# Altium project ESC.PrjPcb (part 1 of 2)
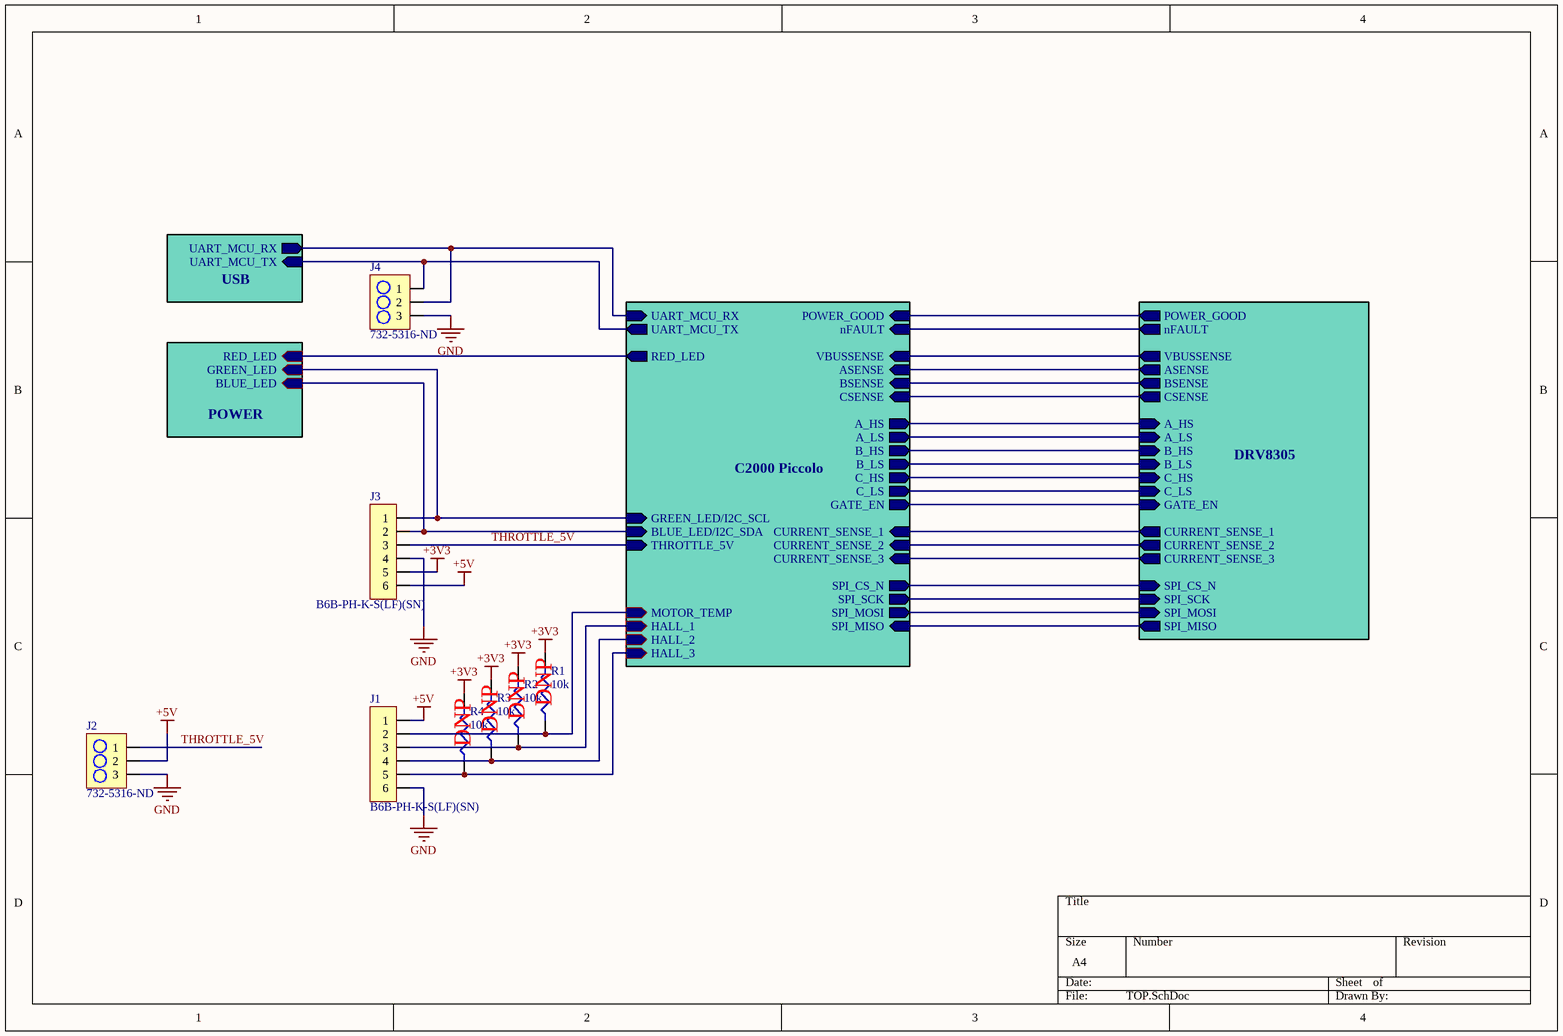
[diagram p0: TOP.SchDoc]
5 sheets, 103 parts. Net scope: hierarchical (ports join the sheet entries above them; power ports are global).
Board file: ESC_BOARD.PcbDoc
Sheets:
  TOP.SchDoc
    C2000 Piccolo = MCU.SchDoc
    DRV8305 = DRIVER.SchDoc
    USB = USB.SchDoc
    POWER = POWER.SchDoc

## Sheet TOP.SchDoc
size A4

### Parts
J1  B6B-PH-K-S(LF)(SN)  [JST-PH-6]
J2  732-5316-ND  [3PIN_HEADER]
J3  B6B-PH-K-S(LF)(SN)  [JST-PH-6]
J4  732-5316-ND  [3PIN_HEADER]
R1  10k  [R0402]
R2  10k  [R0402]
R3  10k  [R0402]
R4  10k  [R0402]

### Sub-sheets
C2000 Piccolo = MCU.SchDoc: VBUSSENSE, ASENSE, BSENSE, CSENSE, A_HS, A_LS, B_HS, B_LS, C_HS, C_LS, GATE_EN, CURRENT_SENSE_1, CURRENT_SENSE_2, CURRENT_SENSE_3, SPI_CS_N, SPI_SCK, SPI_MOSI, SPI_MISO, POWER_GOOD, nFAULT, UART_MCU_RX, UART_MCU_TX, RED_LED, THROTTLE_5V, HALL_3, HALL_1, HALL_2, MOTOR_TEMP, BLUE_LED/I2C_SDA, GREEN_LED/I2C_SCL
DRV8305 = DRIVER.SchDoc: ASENSE, BSENSE, CSENSE, A_HS, A_LS, B_HS, B_LS, C_HS, C_LS, GATE_EN, SPI_CS_N, SPI_SCK, SPI_MOSI, SPI_MISO, nFAULT, POWER_GOOD, VBUSSENSE, CURRENT_SENSE_1, CURRENT_SENSE_2, CURRENT_SENSE_3
POWER = POWER.SchDoc: GREEN_LED, RED_LED, BLUE_LED
USB = USB.SchDoc: UART_MCU_RX, UART_MCU_TX

### Nets
+3V3: J3.5 R1.2 R2.2 R3.2 R4.2
+5V: J1.1 J2.2 J3.6
GND: J1.6 J2.3 J3.4 J4.3
A_HS: sheet C2000 Piccolo/A_HS, sheet DRV8305/A_HS
A_LS: sheet C2000 Piccolo/A_LS, sheet DRV8305/A_LS
ASENSE: sheet C2000 Piccolo/ASENSE, sheet DRV8305/ASENSE
B_HS: sheet C2000 Piccolo/B_HS, sheet DRV8305/B_HS
B_LS: sheet C2000 Piccolo/B_LS, sheet DRV8305/B_LS
BLUE_LED: J3.2 ; sheet C2000 Piccolo/BLUE_LED/I2C_SDA, sheet POWER/BLUE_LED
BSENSE: sheet C2000 Piccolo/BSENSE, sheet DRV8305/BSENSE
C_HS: sheet C2000 Piccolo/C_HS, sheet DRV8305/C_HS
C_LS: sheet C2000 Piccolo/C_LS, sheet DRV8305/C_LS
CSENSE: sheet C2000 Piccolo/CSENSE, sheet DRV8305/CSENSE
CURRENT_SENSE_1: sheet C2000 Piccolo/CURRENT_SENSE_1, sheet DRV8305/CURRENT_SENSE_1
CURRENT_SENSE_2: sheet C2000 Piccolo/CURRENT_SENSE_2, sheet DRV8305/CURRENT_SENSE_2
CURRENT_SENSE_3: sheet C2000 Piccolo/CURRENT_SENSE_3, sheet DRV8305/CURRENT_SENSE_3
GATE_EN: sheet C2000 Piccolo/GATE_EN, sheet DRV8305/GATE_EN
GREEN_LED: J3.1 ; sheet C2000 Piccolo/GREEN_LED/I2C_SCL, sheet POWER/GREEN_LED
HALL_1: J1.3 R2.1 ; sheet C2000 Piccolo/HALL_1
HALL_2: J1.4 R3.1 ; sheet C2000 Piccolo/HALL_2
HALL_3: J1.5 R4.1 ; sheet C2000 Piccolo/HALL_3
MOTOR_TEMP: J1.2 R1.1 ; sheet C2000 Piccolo/MOTOR_TEMP
nFAULT: sheet C2000 Piccolo/nFAULT, sheet DRV8305/nFAULT
POWER_GOOD: sheet C2000 Piccolo/POWER_GOOD, sheet DRV8305/POWER_GOOD
RED_LED: sheet C2000 Piccolo/RED_LED, sheet POWER/RED_LED
SPI_CS_N: sheet C2000 Piccolo/SPI_CS_N, sheet DRV8305/SPI_CS_N
SPI_MISO: sheet C2000 Piccolo/SPI_MISO, sheet DRV8305/SPI_MISO
SPI_MOSI: sheet C2000 Piccolo/SPI_MOSI, sheet DRV8305/SPI_MOSI
SPI_SCK: sheet C2000 Piccolo/SPI_SCK, sheet DRV8305/SPI_SCK
THROTTLE_5V: J2.1 J3.3 ; sheet C2000 Piccolo/THROTTLE_5V
UART_MCU_RX: J4.2 ; sheet C2000 Piccolo/UART_MCU_RX, sheet USB/UART_MCU_RX
UART_MCU_TX: J4.1 ; sheet C2000 Piccolo/UART_MCU_TX, sheet USB/UART_MCU_TX
VBUSSENSE: sheet C2000 Piccolo/VBUSSENSE, sheet DRV8305/VBUSSENSE

### Notes on the sheet
- (near R2) DNP
- (near R1) DNP
- (near R4) DNP
- (near R3) DNP

### Library data of the parts
J1 J3 = B6B-PH-K-S(LF)(SN): CONN JST PH 6 Positions Header, Shrouded Connector 0.079" (2.00mm) Through Hole Tin; Number of Positions: 6; Connector Type: Male Pin; Contact Resistance: 20mR; Current Rating: 2A; Insulation Resistance: 1MR; Max Voltage Rating (AC): 100V; Gender: Male; Pitch: 2mm; Supplier 1: Digi-Key; Manufacturer: JST; Manufacturer Part Number: B6B-PH-K-S(LF)(SN); Stock 1: 75035; Pricing 1: 1=0.33, 10=0.313, 100=0.2194, 500=0.1881, 1000=0.1567, 5000=0.1344, 10000=0.1254 (USD); Mount: Through Hole; Number of Pins: 6; Contact Plating: Copper,Tin; Colour: Natural; Contact Material: Brass,Tin; Housing Colour: White; Housing Material: Polyamide; Min Operating Temperature: -25°C; Max Operating Temperature: 85°C; Number of Rows: 1; Packaging: Bulk; Max Current Rating: 2A; Termination: Solder; Number of Contacts: 6; Orientation: Straight; Voltage Rating (AC): 100V; Voltage Rating: 100V; Fastening Type: Detent; Working Voltage: 100V; Number of Poles: 6; Length: 13.9mm; Height: 9.4mm; Width: 4.5mm; Depth: 4.5mm; Lead Pitch: 2mm; Contact Mating Length: 0.13inch; Lead Free: Lead Free; REACH SVHC: No SVHC; ComponentLink1URL: https://datasheet.ciiva.com/712/eph-712563.pdf; ComponentLink1Description: https://datasheet.ciiva.com/712/eph-712563.pdf; ComponentLink2URL: https://datasheet.ciiva.com/26894/getdatasheetpartid-639917-26894487.pdf; ComponentLink2Description: https://datasheet.ciiva.com/26894/getdatasheetpartid-639917-26894487.pdf; ComponentLink3URL: https://datasheet.ciiva.com/11747/0900766b8082f554-11747368.pdf; ComponentLink3Description: https://datasheet.ciiva.com/11747/0900766b8082f554-11747368.pdf; ComponentLink4URL: https://datasheet.ciiva.com/20207/523648-20207241.pdf; ComponentLink4Description: https://datasheet.ciiva.com/20207/523648-20207241.pdf; ComponentLink5URL: https://datasheet.ciiva.com/8052/80560-8052027.pdf; ComponentLink5Description: https://datasheet.ciiva.com/8052/80560-8052027.pdf; Supplier Part Number 1: 455-1708-ND
J2 J4 = 61300311121: CONN_HeaderPins3pos WURTH ELEKTRONIK Board-To-Board Connector, Vertical, WR-PHD Series, Through Hole, Header, 3 Contacts, 2.54 mm; Manufacturer: Wurth Electronics; Number of Positions: 3; Gender: Male; Connector Type: Male Pin; Pitch: 0.1inch; Supplier 1: Digi-Key; Manufacturer Part Number: 61300311121; Stock 1: 57026; Pricing 1: 1=0.13, 10=0.106, 25=0.088, 50=0.074, 100=0.067, 1000=0.061 (USD); Mount: Through Hole; Case/Package: 100; Contact Plating: Gold; Contact Material: Copper; Colour: Black; Number of Rows: 1; Packaging: Bulk; Termination: Solder; Number of Contacts: 3; Contact Mating Length: 0.236inch; REACH SVHC: Unknown; Lead Free: Lead Free; ComponentLink1URL: http://www.farnell.com/cad/1737268.pdf; ComponentLink1Description: http://www.farnell.com/cad/1737268.pdf; Supplier Part Number 1: 732-5316-ND
R1-R4 = RC0402JR-0710KL: RES SMD 10K OHM 5% 1/16W 0402; Manufacturer: Yageo; Resistance: 10kR; Power Rating: 62.5mW; Voltage Rating: 50V; Temperature Coefficient: 100ppm/°C; Max Power Dissipation: 63mW; Supplier 1: Digi-Key; Manufacturer Part Number: RC0402JR-0710KL; Stock 1: 47303622; Pricing 1: 1=0.1, 10=0.018, 100=0.0073, 1000=0.0033, 2500=0.0029, 5000=0.0024 (USD); Case/Package: 0402; Case Code (Metric): 1005; Case Code (Imperial): 0402; Min Operating Temperature: -55°C; Max Operating Temperature: 155°C; Packaging: Tape and Reel; Tolerance: 5%; Package Quantity: 1; Composition: Thick Film; Number of Terminations: 2; Termination: SMD/SMT; Military Standard: Not; Features: Moisture Resistant; Length: 1mm; Height: 0.016inch; Width: 0.02inch; Depth: 0.5mm; REACH SVHC: Unknown; Lead Free: Lead Free; Supplier Part Number 1: 311-10KJRCT-ND

## Sheet MCU.SchDoc
size A4
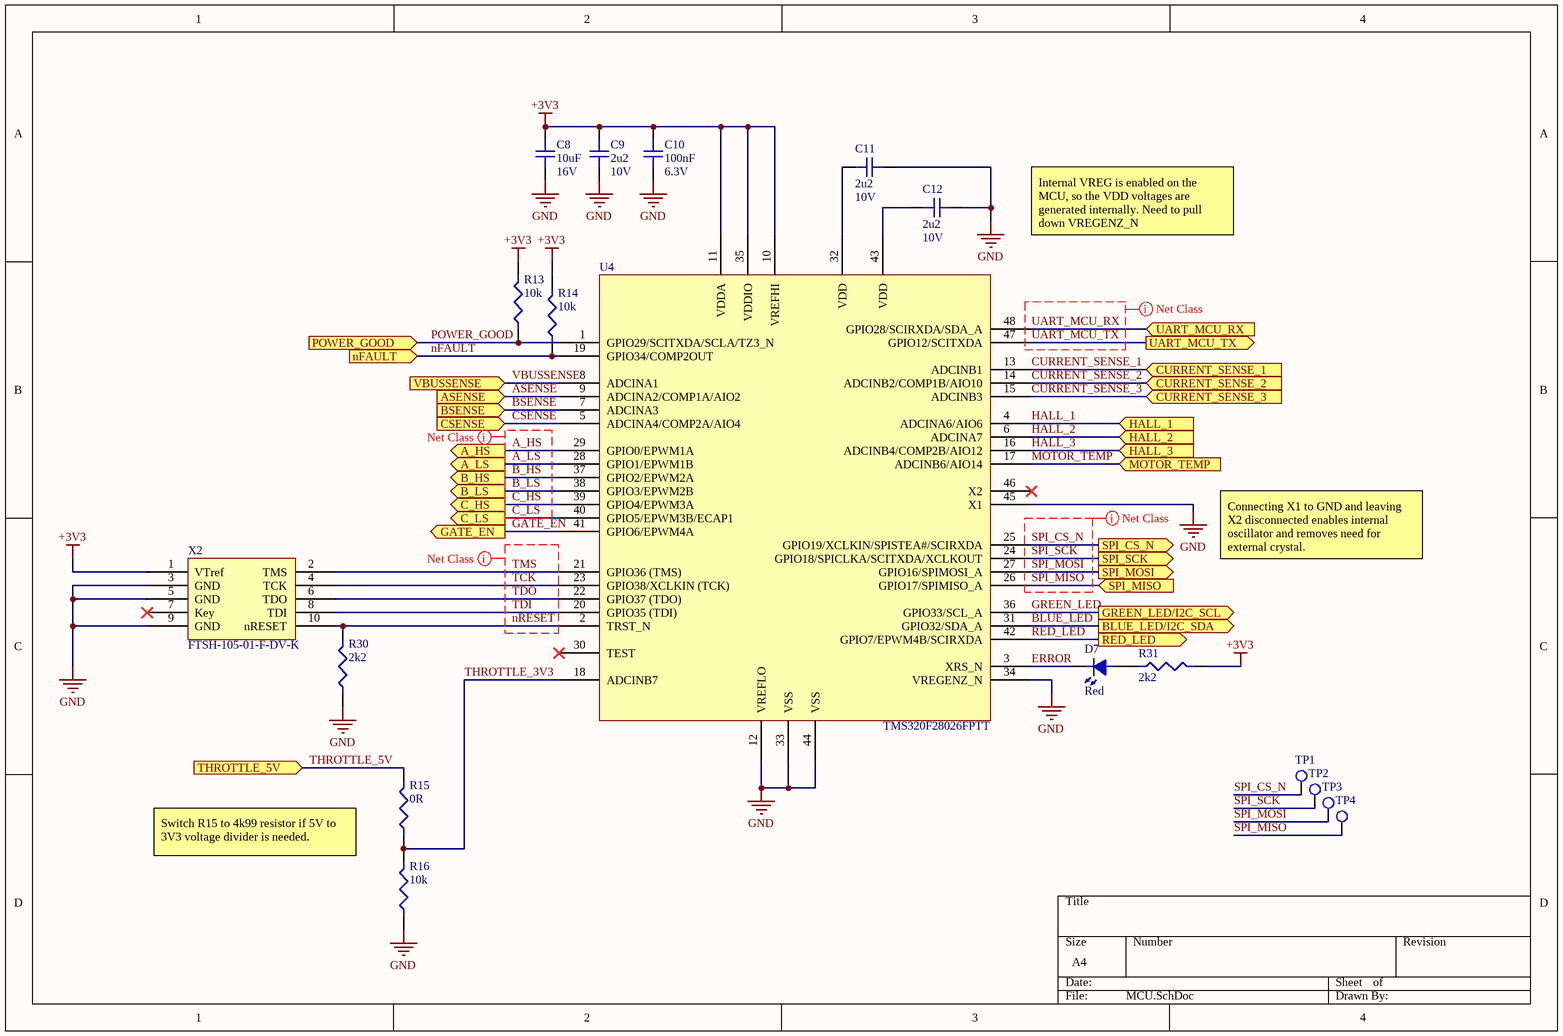
[diagram p1: MCU.SchDoc]

### Parts
C8  10uF  Voltage Rating: 16V  [C0805]
C9  2u2  Voltage Rating: 10V  [C0402]
C10  100nF  Voltage Rating: 6.3V  [C0402]
C11  2u2  Voltage Rating: 10V  [C0402]
C12  2u2  Voltage Rating: 10V  [C0402]
D7  Red  [LED_0603]
R13  10k  [R0402]
R14  10k  [R0402]
R15  0R  [R0402]
R16  10k  [R0402]
R30  2k2  [R0402]
R31  2k2  [R0402]
TP1  5015  [TP_HOOK]  (value not drawn)
TP2  5015  [TP_HOOK]  (value not drawn)
TP3  5015  [TP_HOOK]  (value not drawn)
TP4  5015  [TP_HOOK]  (value not drawn)
U4  TMS320F28026FPTT  [PQFP-48]
X2  FTSH-105-01-F-DV-K  [JTAG_50mil_10pin]

### Ports
A_HS, A_LS, ASENSE, B_HS, B_LS, BLUE_LED/I2C_SDA, BSENSE, C_HS, C_LS, CSENSE, CURRENT_SENSE_1, CURRENT_SENSE_2, CURRENT_SENSE_3, GATE_EN, GREEN_LED/I2C_SCL, HALL_1, HALL_2, HALL_3, MOTOR_TEMP, nFAULT, POWER_GOOD, RED_LED, SPI_CS_N, SPI_MISO, SPI_MOSI, SPI_SCK, THROTTLE_5V, UART_MCU_RX, UART_MCU_TX, VBUSSENSE

### Nets
+3V3: C8.2 C9.2 C10.2 R13.2 R14.2 R31.2 U4.10(VREFHI) U4.11(VDDA) U4.35(VDDIO) X2.1(VTref)
GND: C8.1 C9.1 C10.1 C11.2 C12.2 R16.1 R30.1 U4.12(VREFLO) U4.33(VSS) U4.34(VREGENZ_N) U4.44(VSS) U4.45(X1) X2.3(GND) X2.5(GND) X2.9(GND)
A_HS: U4.29(GPIO0/EPWM1A) ; port A_HS
A_LS: U4.28(GPIO1/EPWM1B) ; port A_LS
ASENSE: U4.9(ADCINA2/COMP1A/AIO2) ; port ASENSE
B_HS: U4.37(GPIO2/EPWM2A) ; port B_HS
B_LS: U4.38(GPIO3/EPWM2B) ; port B_LS
BLUE_LED: U4.31(GPIO32/SDA_A) ; port BLUE_LED/I2C_SDA
BSENSE: U4.7(ADCINA3) ; port BSENSE
C_HS: U4.39(GPIO4/EPWM3A) ; port C_HS
C_LS: U4.40(GPIO5/EPWM3B/ECAP1) ; port C_LS
CSENSE: U4.5(ADCINA4/COMP2A/AIO4) ; port CSENSE
CURRENT_SENSE_1: U4.13(ADCINB1) ; port CURRENT_SENSE_1
CURRENT_SENSE_2: U4.14(ADCINB2/COMP1B/AIO10) ; port CURRENT_SENSE_2
CURRENT_SENSE_3: U4.15(ADCINB3) ; port CURRENT_SENSE_3
ERROR: D7.2 U4.3(XRS_N)
GATE_EN: U4.41(GPIO6/EPWM4A) ; port GATE_EN
GREEN_LED: U4.36(GPIO33/SCL_A) ; port GREEN_LED/I2C_SCL
HALL_1: U4.4(ADCINA6/AIO6) ; port HALL_1
HALL_2: U4.6(ADCINA7) ; port HALL_2
HALL_3: U4.16(ADCINB4/COMP2B/AIO12) ; port HALL_3
MOTOR_TEMP: U4.17(ADCINB6/AIO14) ; port MOTOR_TEMP
nFAULT: R14.1 U4.19(GPIO34/COMP2OUT) ; port nFAULT
nRESET: R30.2 U4.2(TRST_N) X2.10(nRESET)
POWER_GOOD: R13.1 U4.1(GPIO29/SCITXDA/SCLA/TZ3_N) ; port POWER_GOOD
RED_LED: U4.42(GPIO7/EPWM4B/SCIRXDA) ; port RED_LED
SPI_CS_N: TP1.1 U4.25(GPIO19/XCLKIN/SPISTEA#/SCIRXDA) ; port SPI_CS_N
SPI_MISO: TP4.1 U4.26(GPIO17/SPIMISO_A) ; port SPI_MISO
SPI_MOSI: TP3.1 U4.27(GPIO16/SPIMOSI_A) ; port SPI_MOSI
SPI_SCK: TP2.1 U4.24(GPIO18/SPICLKA/SCITXDA/XCLKOUT) ; port SPI_SCK
TCK: U4.23(GPIO38/XCLKIN_(TCK)) X2.4(TCK)
TDI: U4.20(GPIO35_(TDI)) X2.8(TDI)
TDO: U4.22(GPIO37_(TDO)) X2.6(TDO)
THROTTLE_3V3: R15.1 R16.2 U4.18(ADCINB7)
THROTTLE_5V: R15.2 ; port THROTTLE_5V
TMS: U4.21(GPIO36_(TMS)) X2.2(TMS)
UART_MCU_RX: U4.48(GPIO28/SCIRXDA/SDA_A) ; port UART_MCU_RX
UART_MCU_TX: U4.47(GPIO12/SCITXDA) ; port UART_MCU_TX
VBUSSENSE: U4.8(ADCINA1) ; port VBUSSENSE
NetC11_1: C11.1 U4.32(VDD)
NetC12_1: C12.1 U4.43(VDD)
NetD7_1: D7.1 R31.1

Not connected (* = marked no-connect by the designer): U4 30(TEST)* 46(X2)*; X2 7(Key)*

### Layout directives
net class SPI: SPI_CS_N, SPI_MISO, SPI_MOSI, SPI_SCK
net class PWM_GATE_DRIVES: A_HS, A_LS, B_HS, B_LS, C_HS, C_LS
net class JTAG: nRESET, TCK, TDI, TDO, TMS
net class UART: UART_MCU_RX, UART_MCU_TX

### Notes on the sheet
- Internal VREG is enabled on the MCU, so the VDD voltages are generated internally. Need to pull down VREGENZ_N
- Connecting X1 to GND and leaving X2 disconnected enables internal oscillator and removes need for external crystal.
- Switch R15 to 4k99 resistor if 5V to 3V3 voltage divider is needed.

### Library data of the parts
C8 = CL21A106KOQNNNE: CAP CER 10uF 16V X5R 10% SMD 0805 85C T/R; Manufacturer: Samsung; Dielectric: X7R; Supplier 1: Digi-Key; Manufacturer Part Number: CL21A106KOQNNNE; Stock 1: 20000; Pricing 1: 1=0.21, 10=0.148, 100=0.0698, 500=0.0489, 1000=0.0405 (USD); Mount: Surface Mount; Case/Package: 0805; Case Code (Metric): 2012; Case Code (Imperial): 0805; Min Operating Temperature: -55°C; Max Operating Temperature: 85°C; Package Quantity: 1; Packaging: Tape and Reel; Capacitance: 10uF; Tolerance: 10%; Voltage Rating (DC): 16V; Voltage: 16V; Length: 2mm; Height: 1.25mm; Width: 0.049inch; Thickness: 0.055inch; Depth: 1.25mm; Radiation Hardening: No; Lead Free: Lead Free; ComponentLink1URL: https://datasheet.ciiva.com/25798/cl21a106koqnnne-25798133.pdf; ComponentLink1Description: https://datasheet.ciiva.com/25798/cl21a106koqnnne-25798133.pdf; ComponentLink2URL: https://datasheet.ciiva.com/16740/cl05b104kq5nnnc-16740697.pdf; ComponentLink2Description: https://datasheet.ciiva.com/16740/cl05b104kq5nnnc-16740697.pdf; ComponentLink3URL: https://datasheet.ciiva.com/15216/getdatasheetpartid-358435-15216234.pdf; ComponentLink3Description: https://datasheet.ciiva.com/15216/getdatasheetpartid-358435-15216234.pdf; Supplier Part Number 1: 1276-1096-1-ND
C9 C11 C12 = GRM155R61A225ME95D: CAP CER 2.2uF 10V X5R 20% SMD 0402 85C Paper T/R; Manufacturer: Murata; Supplier 1: Digi-Key; Manufacturer Part Number: GRM155R61A225ME95D; Stock 1: 100000; Pricing 1: 1=0.13, 10=0.096, 100=0.045, 500=0.0316, 1000=0.0261, 2500=0.0243, 5000=0.0223 (USD); Mount: Surface Mount; Case/Package: 0402; Case Code (Metric): 1005; Case Code (Imperial): 0402; Min Operating Temperature: -55°C; Max Operating Temperature: 85°C; Tolerance: 20%; Packaging: Tape and Reel; Dielectric: X5R; Capacitance: 2.2uF; Voltage Rating (DC): 10V; Length: 0.039inch; Width: 0.02inch; Thickness: 0.022inch; Depth: 0.5mm; Supplier Part Number 1: 490-10452-1-ND
C10 = CL05B104KQ5NNNC: CAP CER 0.1uF 6.3V X7R 10% SMD 0402 125C Paper T/R; Manufacturer: Samsung; Supplier 1: Digi-Key; Manufacturer Part Number: CL05B104KQ5NNNC; Stock 1: 100000; Pricing 1: 1=0.1, 10=0.03, 100=0.0134, 500=0.0096, 1000=0.0075, 2500=0.0068, 5000=0.0063 (USD); Mount: Surface Mount; Case/Package: 0402; Case Code (Metric): 1005; Case Code (Imperial): 0402; Min Operating Temperature: -55°C; Max Operating Temperature: 125°C; Tolerance: 10%; Packaging: Tape and Reel; Capacitance: 100nF; Dielectric: X7R; Voltage Rating (DC): 6.3V; Length: 1mm; Height: 0.5mm; Width: 0.02inch; Thickness: 0.022inch; Depth: 0.5mm; Radiation Hardening: No; Lead Free: Lead Free; Supplier Part Number 1: 1276-1511-1-ND
D7 = LTST-C191KRKT: LED RED CLEAR 0603 SMD; Manufacturer: Vishay Lite-On; Lens Colour: Colorless; Power Rating: 75mW; Luminous Intensity: 54mcd; Viewing Angle: 130°; Forward Voltage: 2V; Lens Style: Clear,Diffused,Colorless,Rectangular; Forward Current: 30mA; Dominant Wavelength: 631nm; Test Current: 20mA; Number of Elements: 1; Wavelength: 639nm; Reverse Voltage: 5V; Supplier 1: Digi-Key; Manufacturer Part Number: LTST-C191KRKT; Stock 1: 684119; Pricing 1: 1=0.29, 10=0.211, 25=0.1556, 100=0.1111, 250=0.0756, 500=0.0667, 1000=0.0522, 2500=0.0511 (USD); Mount: Surface Mount; Case/Package: 0603; Number of Pins: 2; Colour: Red; Case Code (Metric): 1608; Case Code (Imperial): 0603; Min Operating Temperature: -55°C; Max Operating Temperature: 85°C; Packaging: Tape and Reel; Package Quantity: 1; Illumination Colour: Red; Lens Transparency: Clear; Power Dissipation: 75mW; Number of LEDs: 1; Voltage: 2V; Length: 1.6mm; Height: 0.55mm; Width: 0.8mm; Depth: 0.8mm; Radiation Hardening: No; Lead Free: Lead Free; ComponentLink1URL: https://datasheet.ciiva.com/11773/0900766b80dc02b2-11773601.pdf; ComponentLink1Description: https://datasheet.ciiva.com/11773/0900766b80dc02b2-11773601.pdf; ComponentLink2URL: https://datasheet.ciiva.com/2109/s-110-ltst-c191krkt-2109970.pdf; ComponentLink2Description: https://datasheet.ciiva.com/2109/s-110-ltst-c191krkt-2109970.pdf; ComponentLink3URL: https://datasheet.ciiva.com/2109/s-110-ltst-c191krkt-2109971.pdf; ComponentLink3Description: https://datasheet.ciiva.com/2109/s-110-ltst-c191krkt-2109971.pdf; ComponentLink4URL: https://datasheet.ciiva.com/16212/ltst-c191krkt-16212419.pdf; ComponentLink4Description: https://datasheet.ciiva.com/16212/ltst-c191krkt-16212419.pdf; ComponentLink5URL: https://datasheet.ciiva.com/2109/s-110-ltst-c191krkt-2109972.pdf; ComponentLink5Description: https://datasheet.ciiva.com/2109/s-110-ltst-c191krkt-2109972.pdf; ComponentLink6URL: https://datasheet.ciiva.com/15117/getdatasheetpartid-141922-15117737.pdf; ComponentLink6Description: https://datasheet.ciiva.com/15117/getdatasheetpartid-141922-15117737.pdf; ComponentLink7URL: https://datasheet.ciiva.com/12400/lite-on-ltst-c191krkt-190135-12400910.pdf; ComponentLink7Description: https://datasheet.ciiva.com/12400/lite-on-ltst-c191krkt-190135-12400910.pdf; Supplier Part Number 1: 160-1447-1-ND
R13 R14 R16 = RC0402JR-0710KL: as R1 on sheet TOP; Supplier 1: Digi-Key; Manufacturer Part Number: RC0402JR-0710KL; Stock 1: 47303622; Pricing 1: 1=0.1, 10=0.018, 100=0.0073, 1000=0.0033, 2500=0.0029, 5000=0.0024 (USD); Case/Package: 0402; Case Code (Metric): 1005; Case Code (Imperial): 0402; Min Operating Temperature: -55°C; Max Operating Temperature: 155°C; Packaging: Tape and Reel; Tolerance: 5%; Package Quantity: 1; Composition: Thick Film; Number of Terminations: 2; Termination: SMD/SMT; Military Standard: Not; Features: Moisture Resistant; Length: 1mm; Height: 0.016inch; Width: 0.02inch; Depth: 0.5mm; REACH SVHC: Unknown; Lead Free: Lead Free; Supplier Part Number 1: 311-10KJRCT-ND
R15 = RC0402JR-070RL: RES SMD 0 OHM 1/16W 0402; Manufacturer: Yageo; Resistance: 0mR; Power Rating: 62.5mW; Tolerance: 5%; Voltage Rating: 50V; Max Power Dissipation: 63mW; Temperature Coefficient: 200ppm/°C; Supplier 1: Digi-Key; Manufacturer Part Number: RC0402JR-070RL; Stock 1: 44333412; Pricing 1: 1=0.1, 10=0.017, 25=0.0124, 50=0.0096, 100=0.007, 250=0.0054, 500=0.0043, 1000=0.0032, 5000=0.0023 (USD); Case/Package: 0402; Contact Plating: Matte,Tin; Case Code (Metric): 1005; Case Code (Imperial): 0402; Min Operating Temperature: -55°C; Max Operating Temperature: 155°C; Packaging: Tape and Reel; Composition: Thick Film; Package Quantity: 1; Number of Terminations: 2; Termination: SMD/SMT; Military Standard: Not; Features: Moisture Resistant; Length: 1mm; Height: 0.016inch; Width: 0.02inch; Depth: 0.5mm; Radiation Hardening: No; REACH SVHC: Unknown; Lead Free: Lead Free; Supplier Part Number 1: 311-0.0JRCT-ND
R30 R31 = RC0402JR-072K2L: RES SMD 2.2K OHM 5% 1/16W 0402; Manufacturer: Yageo; Resistance: 2.2kR; Power Rating: 63mW; Voltage Rating: 50V; Temperature Coefficient: 100ppm/°C; Supplier 1: Digi-Key; Manufacturer Part Number: RC0402JR-072K2L; Stock 1: 7890813; Pricing 1: 1=0.1, 10=0.018, 100=0.0073, 1000=0.0033, 2500=0.0029, 5000=0.0024 (USD); Case/Package: 0402; Weight: 2.3E-05oz; Case Code (Metric): 1005; Case Code (Imperial): 0402; Min Operating Temperature: -55°C; Max Operating Temperature: 155°C; Tolerance: 5%; Packaging: Tape and Reel; Composition: Thick Film; Termination: SMD/SMT; Military Standard: Not; Package Quantity: 1; Number of Terminations: 2; Max Power Dissipation: 63mW; Working Voltage: 50V; Features: Moisture Resistant; Length: 1mm; Height: 0.016inch; Depth: 0.5mm; Width: 0.02inch; REACH SVHC: Unknown; Lead Free: Lead Free; Supplier Part Number 1: 311-2.2KJRCT-ND
TP1-TP4 = 5015: TEST POINT, PCB, SMT; Manufacturer: Keystone Electronics; Number of Ports: 1; Supplier 1: Digi-Key; Manufacturer Part Number: 5015; Stock 1: 1937775; Pricing 1: 1=0.44, 10=0.421, 25=0.3604, 50=0.3064, 100=0.2944, 250=0.2644, 500=0.2524 (USD); Mount: Surface Mount; Colour: White; Contact Material: Bronze; Contact Plating: Tin,Silver,Lead; Material: Bronze,Silver; Package Quantity: 1; Packaging: Tape and Reel; Termination: Solder; Orientation: Straight; Length: 2.66mm; Height: 0.06inch; Thickness: 0.01inch; Depth: 1.01mm; REACH SVHC: No SVHC; Lead Free: Lead Free; ComponentLink1URL: https://datasheet.ciiva.com/2917/5015-2917616.pdf; ComponentLink1Description: https://datasheet.ciiva.com/2917/5015-2917616.pdf; ComponentLink2URL: https://datasheet.ciiva.com/2917/5015-2917617.pdf; ComponentLink2Description: https://datasheet.ciiva.com/2917/5015-2917617.pdf; ComponentLink3URL: https://datasheet.ciiva.com/1123/5015-1123862.pdf; ComponentLink3Description: https://datasheet.ciiva.com/1123/5015-1123862.pdf; ComponentLink4URL: https://datasheet.ciiva.com/16883/70182998-16883734.pdf; ComponentLink4Description: https://datasheet.ciiva.com/16883/70182998-16883734.pdf; Supplier Part Number 1: 36-5015CT-ND
U4 = TMS320F28026FPTT: IC MCU 32-bit Piccolo F2802x C28x RISC 32KB Flash 3.3V 48-Pin LQFP T/R; Manufacturer: Texas Instruments; Min Supply Voltage: 2.97V; Max Supply Voltage: 3.63V; RAM Size: 12KB; Interface: I2C,SPI,UART,USART,SCI; Number of I/Os: 22; Number of Timers/Counters: 3; Frequency: 60MHz; Number of ADC Channels: 8; Oscillator Type: Internal; Data Bus Width: 32b; Max Frequency: 50MHz; Number of UART Channels: 1; Peripherals: Brown-out Detect/Reset,POR,PWM,WDT; Supplier 1: Digi-Key; Manufacturer Part Number: TMS320F28026FPTT; Stock 1: 202; Pricing 1: 1=7.19, 10=6.499, 100=5.3809 (USD); Mount: Surface Mount; Case/Package: LQFP; Number of Pins: 48; Min Operating Temperature: -40°C; Max Operating Temperature: 105°C; Packaging: Tape and Reel; Package Quantity: 250; Operating Supply Voltage: 3.3V; Number of Programmable I/O: 22; Memory Type: FLASH; Memory Size: 32KB; Radiation Hardening: No; REACH SVHC: No SVHC; Lead Free: Lead Free; ComponentLink1URL: https://datasheet.ciiva.com/6656/tms320f28020-6656816.pdf; ComponentLink1Description: https://datasheet.ciiva.com/6656/tms320f28020-6656816.pdf; ComponentLink2URL: https://datasheet.ciiva.com/23944/tms320f28026-23944835.pdf; ComponentLink2Description: https://datasheet.ciiva.com/23944/tms320f28026-23944835.pdf; ComponentLink3URL: https://datasheet.ciiva.com/28626/1827035-28626823.pdf; ComponentLink3Description: https://datasheet.ciiva.com/28626/1827035-28626823.pdf; ComponentLink4URL: https://datasheet.ciiva.com/29722/tms320f28026f-29722007.pdf; ComponentLink4Description: https://datasheet.ciiva.com/29722/tms320f28026f-29722007.pdf; ComponentLink5URL: https://datasheet.ciiva.com/29986/tms320f28026-29986743.pdf; ComponentLink5Description: https://datasheet.ciiva.com/29986/tms320f28026-29986743.pdf; ComponentLink6URL: https://datasheet.ciiva.com/29722/tms320f28026f-29722008.pdf; ComponentLink6Description: https://datasheet.ciiva.com/29722/tms320f28026f-29722008.pdf; ComponentLink7URL: https://datasheet.ciiva.com/29986/tms320f28026-29986744.pdf; ComponentLink7Description: https://datasheet.ciiva.com/29986/tms320f28026-29986744.pdf; ComponentLink8URL: https://datasheet.ciiva.com/16383/sprs523j-317502-16383180.pdf; ComponentLink8Description: https://datasheet.ciiva.com/16383/sprs523j-317502-16383180.pdf; Supplier Part Number 1: 296-36529-ND
X2 = FTSH-105-01-F-DV-K: CONN_JTAG_10pin .050 Connector Dual Header 10 Position Surface Mount; Manufacturer: Samtec; Max Current Rating: 1.75A; Number of Positions: 10; Connector Type: Male Pin; Pitch: 1.27mm; Row Spacing: 0.05inch; Supplier 1: Digi-Key; Manufacturer Part Number: FTSH-105-01-F-DV-K; Stock 1: 18199; Pricing 1: 1=2.9, 10=2.784, 100=2.32, 500=1.972, 1000=1.682, 5000=1.508 (USD); Mount: Surface Mount; Contact Material: Bronze,Copper; Contact Plating: Nickel,Gold; Colour: Black; Housing Colour: Black; Housing Material: Polymer; Min Operating Temperature: -55°C; Max Operating Temperature: 125°C; Number of Rows: 2; Packaging: Rail/Tube; Package Quantity: 1; Termination: Solder; Number of Contacts: 10; Orientation: Straight; Length: 15.2mm; Height: 3.3mm; Contact Mating Length: 0.12inch; Depth: 3.43mm; Radiation Hardening: No; Lead Free: Lead Free; ComponentLink1URL: https://datasheet.ciiva.com/19461/2046846-19461026.pdf; ComponentLink1Description: https://datasheet.ciiva.com/19461/2046846-19461026.pdf; ComponentLink2URL: https://datasheet.ciiva.com/738/ftsh-1xx-xx-xxx-dv-xxx-mkt-738998.pdf; ComponentLink2Description: https://datasheet.ciiva.com/738/ftsh-1xx-xx-xxx-dv-xxx-mkt-738998.pdf; ComponentLink3URL: https://datasheet.ciiva.com/10245/ftsh-mt-10245273.pdf; ComponentLink3Description: https://datasheet.ciiva.com/10245/ftsh-mt-10245273.pdf; ComponentLink4URL: https://datasheet.ciiva.com/16657/ftsh-mt-16657371.pdf; ComponentLink4Description: https://datasheet.ciiva.com/16657/ftsh-mt-16657371.pdf; ComponentLink5URL: https://datasheet.ciiva.com/15195/getdatasheetpartid-133463-15195260.pdf; ComponentLink5Description: https://datasheet.ciiva.com/15195/getdatasheetpartid-133463-15195260.pdf; Supplier Part Number 1: SAM8796-ND

## Sheet DRIVER.SchDoc
size A4
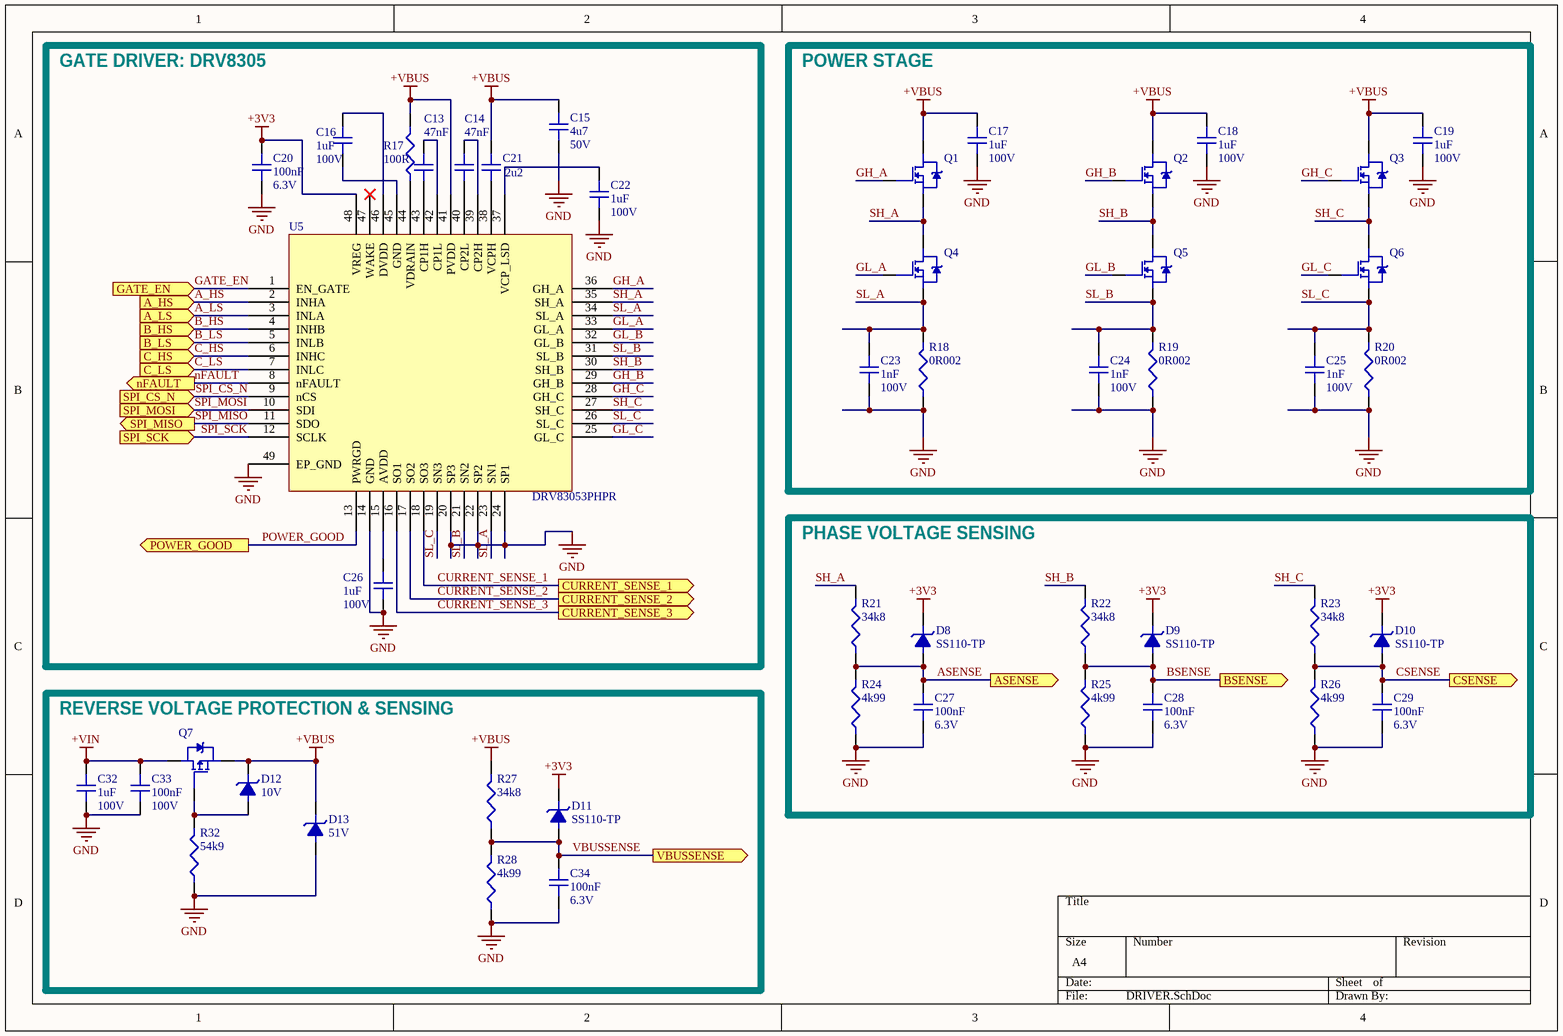
[diagram p2: DRIVER.SchDoc]

### Parts
C13  47nF  [C0402]
C14  47nF  [C0402]
C15  4u7  Voltage Rating: 50V  [C0805]
C16  1uF  Voltage Rating: 100V  [C0805]
C17  1uF  Voltage Rating: 100V  [C0805]
C18  1uF  Voltage Rating: 100V  [C0805]
C19  1uF  Voltage Rating: 100V  [C0805]
C20  100nF  Voltage Rating: 6.3V  [C0402]
C21  2u2  [C0805]
C22  1uF  Voltage Rating: 100V  [C0805]
C23  1nF  Voltage: 100V  [C0402]
C24  1nF  Voltage: 100V  [C0402]
C25  1nF  Voltage: 100V  [C0402]
C26  1uF  Voltage Rating: 100V  [C0805]
C27  100nF  Voltage Rating: 6.3V  [C0402]
C28  100nF  Voltage Rating: 6.3V  [C0402]
C29  100nF  Voltage Rating: 6.3V  [C0402]
C32  1uF  Voltage Rating: 100V  [C0805]
C33  100nF  Voltage Rating: 100V  [C0805]
C34  100nF  Voltage Rating: 6.3V  [C0805]
D8  SS110-TP  [DO-214AA_Diode]
D9  SS110-TP  [DO-214AA_Diode]
D10  SS110-TP  [DO-214AA_Diode]
D11  SS110-TP  [DO-214AA_Diode]
D12  10V  [DO-214AC]
D13  51V  [DO-214AB]
Q1  SIR186DP-T1-RE3  [SO-8 PowerPAK]  (value not drawn)
Q2  SIR186DP-T1-RE3  [SO-8 PowerPAK]  (value not drawn)
Q3  SIR186DP-T1-RE3  [SO-8 PowerPAK]  (value not drawn)
Q4  SIR186DP-T1-RE3  [SO-8 PowerPAK]  (value not drawn)
Q5  SIR186DP-T1-RE3  [SO-8 PowerPAK]  (value not drawn)
Q6  SIR186DP-T1-RE3  [SO-8 PowerPAK]  (value not drawn)
Q7  FDWS9509L-F085  [SO-8 PowerPAK]  (value not drawn)
R17  100R  [R0402]
R18  0R002  [R2512]
R19  0R002  [R2512]
R20  0R002  [R2512]
R21  34k8  [R0402]
R22  34k8  [R0402]
R23  34k8  [R0402]
R24  4k99  [R0402]
R25  4k99  [R0402]
R26  4k99  [R0402]
R27  34k8  [R0402]
R28  4k99  [R0402]
R32  54k9  [R0402]
U5  DRV83053PHPR  [PQFP_EP-48]

### Blocks framed on the sheet
GATE DRIVER: DRV8305: C13-C16 C20-C22 C26 R17 U5
POWER STAGE: C17-C19 C23-C25 Q1-Q6 R18-R20
PHASE VOLTAGE SENSING: C27-C29 D8-D10 R21-R26
REVERSE VOLTAGE PROTECTION & SENSING: C32-C34 D11-D13 Q7 R27 R28 R32

### Ports
A_HS, A_LS, ASENSE, B_HS, B_LS, BSENSE, C_HS, C_LS, CSENSE, CURRENT_SENSE_1, CURRENT_SENSE_2, CURRENT_SENSE_3, GATE_EN, nFAULT, POWER_GOOD, SPI_CS_N, SPI_MISO, SPI_MOSI, SPI_SCK, VBUSSENSE

### Nets
+3V3: C20.2 D8.2 D9.2 D10.2 D11.2 U5.48(VREG)
+VBUS: C15.2 C17.2 C18.2 C19.2 C21.2 D12.1 D13.1 Q1.2 Q2.2 Q3.2 Q7.3 R17.2 R27.2 U5.41(PVDD)
+VIN: C32.2 C33.2 Q7.2
GND: C15.1 C17.1 C18.1 C19.1 C20.1 C22.1 C23.1 C24.1 C25.1 C26.1 C27.1 C28.1 C29.1 C32.1 C33.1 C34.1 D13.2 R18.1 R19.1 R20.1 R24.1 R25.1 R26.1 R28.1 R32.1 U5.14(GND) U5.20(SP3) U5.22(SP2) U5.24(SP1) U5.49(EP_GND)
A_HS: U5.2(INHA) ; port A_HS
A_LS: U5.3(INLA) ; port A_LS
ASENSE: C27.2 D8.1 R21.1 R24.2 ; port ASENSE
B_HS: U5.4(INHB) ; port B_HS
B_LS: U5.5(INLB) ; port B_LS
BSENSE: C28.2 D9.1 R22.1 R25.2 ; port BSENSE
C_HS: U5.6(INHC) ; port C_HS
C_LS: U5.7(INLC) ; port C_LS
CSENSE: C29.2 D10.1 R23.1 R26.2 ; port CSENSE
CURRENT_SENSE_1: U5.18(SO3) ; port CURRENT_SENSE_1
CURRENT_SENSE_2: U5.17(SO2) ; port CURRENT_SENSE_2
CURRENT_SENSE_3: U5.16(SO1) ; port CURRENT_SENSE_3
GATE_EN: U5.1(EN_GATE) ; port GATE_EN
GH_A: Q1.1 U5.36(GH_A)
GH_B: Q2.1 U5.29(GH_B)
GH_C: Q3.1 U5.28(GH_C)
GL_A: Q4.1 U5.33(GL_A)
GL_B: Q5.1 U5.32(GL_B)
GL_C: Q6.1 U5.25(GL_C)
nFAULT: U5.8(nFAULT) ; port nFAULT
POWER_GOOD: U5.13(PWRGD) ; port POWER_GOOD
SH_A: Q1.3 Q4.2 R21.2 U5.35(SH_A)
SH_B: Q2.3 Q5.2 R22.2 U5.30(SH_B)
SH_C: Q3.3 Q6.2 R23.2 U5.27(SH_C)
SL_A: C23.2 Q4.3 R18.2 U5.23(SN1) U5.34(SL_A)
SL_B: C24.2 Q5.3 R19.2 U5.21(SN2) U5.31(SL_B)
SL_C: C25.2 Q6.3 R20.2 U5.19(SN3) U5.26(SL_C)
SPI_CS_N: U5.9(nCS) ; port SPI_CS_N
SPI_MISO: U5.11(SDO) ; port SPI_MISO
SPI_MOSI: U5.10(SDI) ; port SPI_MOSI
SPI_SCK: U5.12(SCLK) ; port SPI_SCK
VBUSSENSE: C34.2 D11.1 R27.1 R28.2 ; port VBUSSENSE
NetC13_1: C13.1 U5.43(CP1H)
NetC13_2: C13.2 U5.42(CP1L)
NetC14_1: C14.1 U5.40(CP2L)
NetC14_2: C14.2 U5.39(CP2H)
NetC16_1: C16.1 U5.45(GND)
NetC16_2: C16.2 U5.46(DVDD)
NetC21_1: C21.1 U5.38(VCPH)
NetC22_2: C22.2 U5.37(VCP_LSD)
NetC26_2: C26.2 U5.15(AVDD)
NetD12_2: D12.2 Q7.1 R32.2
NetR17_1: R17.1 U5.44(VDRAIN)

Not connected (* = marked no-connect by the designer): U5 47(WAKE)*

### Library data of the parts
C13 C14 = CGA2B3X7R1H473K050BB: CAP CER 0.047uF 50 V,  10%, X7R, CGA Series; Manufacturer: TDK; Voltage Rating (DC): 50V; Supplier 1: Digi-Key; Manufacturer Part Number: CGA2B3X7R1H473K050BB; Stock 1: 76108; Pricing 1: 1=0.13, 10=0.099, 100=0.0439, 500=0.0314, 1000=0.0247, 2500=0.0224, 5000=0.0206 (USD); Mount: Surface Mount; Case/Package: 0402; Weight: 2.3E-05oz; Case Code (Metric): 1005; Case Code (Imperial): 0402; Min Operating Temperature: -55°C; Max Operating Temperature: 125°C; Capacitance: 47nF; Tolerance: 10%; Packaging: Tape and Reel; Package Quantity: 1; Dielectric: X7R; Termination: SMD/SMT; Composition: Ceramic; Length: 1mm; Height: 0.5mm; Width: 0.02inch; Thickness: 0.022inch; Depth: 0.5mm; Ratings: AEC-Q200; Radiation Hardening: No; REACH SVHC: No SVHC; Lead Free: Lead Free; Supplier Part Number 1: 445-6897-1-ND; Voltage Rating: 50V
C15 = CL21A475KBQNNNE: CAP CER 4.7uF 50V X5R 10% SMD 0805 85C Embossed T/R; Manufacturer: Samsung; Supplier 1: Digi-Key; Manufacturer Part Number: CL21A475KBQNNNE; Stock 1: 20000; Pricing 1: 1=0.44, 10=0.309, 100=0.1854, 500=0.1391, 1000=0.1174 (USD); Mount: Surface Mount; Case/Package: 0805; Case Code (Metric): 2012; Case Code (Imperial): 0805; Min Operating Temperature: -55°C; Max Operating Temperature: 85°C; Tolerance: 10%; Packaging: Tape and Reel; Package Quantity: 1; Capacitance: 4.7uF; Dielectric: X5R; Length: 2mm; Width: 0.049inch; Thickness: 0.055inch; Depth: 1.25mm; Radiation Hardening: No; ComponentLink1URL: https://datasheet.ciiva.com/25797/cl21a475kbqnnne-25797730.pdf; ComponentLink1Description: https://datasheet.ciiva.com/25797/cl21a475kbqnnne-25797730.pdf; ComponentLink2URL: https://datasheet.ciiva.com/26838/getdatasheetpartid-470982-26838620.pdf; ComponentLink2Description: https://datasheet.ciiva.com/26838/getdatasheetpartid-470982-26838620.pdf; ComponentLink3URL: https://datasheet.ciiva.com/16428/cl21a475kbqnnne-16428877.pdf; ComponentLink3Description: https://datasheet.ciiva.com/16428/cl21a475kbqnnne-16428877.pdf; Supplier Part Number 1: 1276-1248-1-ND
C16-C19 C22 C26 C32 = C2012X7S2A105M125AE: CAP CER 1UF 100V X7S 0805; Manufacturer: TDK; Tolerance: 20%; Supplier 1: Digi-Key; Manufacturer Part Number: C2012X7S2A105M125AE; Stock 1: 20000; Pricing 1: 1=0.5, 10=0.356, 100=0.2347, 500=0.1739, 1000=0.1478 (USD); Mount: Surface Mount; Case/Package: 0805; Weight: 0.000194oz; Case Code (Imperial): 0805; Case Code (Metric): 2012; Min Operating Temperature: -55°C; Max Operating Temperature: 125°C; Capacitance: 1uF; Voltage Rating (DC): 100V; Packaging: Tape and Reel; Package Quantity: 1; Dielectric: X7S; Termination: SMD/SMT; Composition: Ceramic; Length: 2mm; Height: 1.45mm; Width: 1.2mm; Thickness: 0.057inch; Lead Free: Lead Free; ComponentLink1URL: https://datasheet.ciiva.com/24216/c2012x7s2a105m125ae-265183-24216851.pdf; ComponentLink1Description: https://datasheet.ciiva.com/24216/c2012x7s2a105m125ae-265183-24216851.pdf; ComponentLink2URL: https://datasheet.ciiva.com/6287/mlcc-commercial-soft-en-6287845.pdf; ComponentLink2Description: https://datasheet.ciiva.com/6287/mlcc-commercial-soft-en-6287845.pdf; ComponentLink3URL: https://datasheet.ciiva.com/6287/mlcc-commercial-soft-en-6287849.pdf; ComponentLink3Description: https://datasheet.ciiva.com/6287/mlcc-commercial-soft-en-6287849.pdf; ComponentLink4URL: https://datasheet.ciiva.com/6287/mlcc-commercial-soft-en-6287854.pdf; ComponentLink4Description: https://datasheet.ciiva.com/6287/mlcc-commercial-soft-en-6287854.pdf; Supplier Part Number 1: 445-6804-1-ND
C20 C27-C29 = CL05B104KQ5NNNC: as C10 on sheet MCU; Supplier 1: Digi-Key; Manufacturer Part Number: CL05B104KQ5NNNC; Stock 1: 100000; Pricing 1: 1=0.1, 10=0.03, 100=0.0134, 500=0.0096, 1000=0.0075, 2500=0.0068, 5000=0.0063 (USD); Mount: Surface Mount; Case/Package: 0402; Case Code (Metric): 1005; Case Code (Imperial): 0402; Min Operating Temperature: -55°C; Max Operating Temperature: 125°C; Tolerance: 10%; Packaging: Tape and Reel; Capacitance: 100nF; Dielectric: X7R; Voltage Rating (DC): 6.3V; Length: 1mm; Height: 0.5mm; Width: 0.02inch; Thickness: 0.022inch; Depth: 0.5mm; Radiation Hardening: No; Lead Free: Lead Free; Supplier Part Number 1: 1276-1511-1-ND
C21 = C2012X5R1H225M125AB: CAP CER 2.2UF 50V X5R 0805; Manufacturer: TDK; Dielectric Material: Ceramic; Tolerance: 20%; Supplier 1: Digi-Key; Manufacturer Part Number: C2012X5R1H225M125AB; Stock 1: 2000; Pricing 1: 1=0.67, 10=0.472, 100=0.3105, 500=0.23, 1000=0.1955 (USD); Mount: Surface Mount; Case/Package: 0805; Weight: 0.000194oz; Case Code (Metric): 2012; Case Code (Imperial): 0805; Min Operating Temperature: -55°C; Max Operating Temperature: 85°C; Packaging: Tape and Reel; Capacitance: 2.2uF; Package Quantity: 1; Voltage Rating (DC): 50V; Dielectric: X5R; Termination: SMD/SMT; Composition: Ceramic; Length: 2mm; Height: 1.25mm; Width: 0.049inch; Thickness: 0.057inch; Depth: 1.25mm; Lead Free: Lead Free; ComponentLink1URL: https://datasheet.ciiva.com/6287/tdkmlcccaprange-6287511.pdf; ComponentLink1Description: https://datasheet.ciiva.com/6287/tdkmlcccaprange-6287511.pdf; ComponentLink2URL: https://datasheet.ciiva.com/6287/tdkmlcccaprange-6287514.pdf; ComponentLink2Description: https://datasheet.ciiva.com/6287/tdkmlcccaprange-6287514.pdf; ComponentLink3URL: https://datasheet.ciiva.com/6287/tdkmlcccaprange-6287516.pdf; ComponentLink3Description: https://datasheet.ciiva.com/6287/tdkmlcccaprange-6287516.pdf; ComponentLink4URL: https://datasheet.ciiva.com/24221/c2012x5r1h225m125ab-265113-24221566.pdf; ComponentLink4Description: https://datasheet.ciiva.com/24221/c2012x5r1h225m125ab-265113-24221566.pdf; Supplier Part Number 1: 445-5977-1-ND; Voltage Rating: 50V
C23-C25 = GCM155R72A102KA37D: CAP CER 1000PF 100V X7R 0402; Manufacturer: Murata; Tolerance: 10%; Supplier 1: Digi-Key; Manufacturer Part Number: GCM155R72A102KA37D; Stock 1: 100000; Pricing 1: 1=0.1, 10=0.058, 100=0.026, 500=0.0186, 1000=0.0146, 2500=0.0133, 5000=0.0122 (USD); Mount: Surface Mount; Case/Package: 0402; Case Code (Metric): 1005; Case Code (Imperial): 0402; Min Operating Temperature: -55°C; Max Operating Temperature: 125°C; Package Quantity: 1; Capacitance: 1nF; Voltage Rating: 100V; Packaging: Tape and Reel; Dielectric: X7R; Voltage Rating (DC): 100V; Termination: SMD/SMT; Length: 1mm; Height: 0.5mm; Width: 0.02inch; Thickness: 0.022inch; Depth: 0.5mm; Ratings: AEC-Q200; Radiation Hardening: No; REACH SVHC: No SVHC; Supplier Part Number 1: 490-4764-1-ND
C33 = CL21B104KCFWPNE: CAP CER 0.10µF 100V Ceramic Capacitor X7R 0805 (2012 Metric) 0.079" L x 0.049" W (2.00mm x 1.25mm); Manufacturer: Samsung; Tolerance: 10%; Supplier 1: Digi-Key; Manufacturer Part Number: CL21B104KCFWPNE; Stock 1: 6000; Pricing 1: 1=0.17, 10=0.118, 100=0.0556, 500=0.039, 1000=0.0323 (USD); Mount: Surface Mount; Case/Package: 0805; Case Code (Metric): 2012; Case Code (Imperial): 0805; Min Operating Temperature: -55°C; Max Operating Temperature: 125°C; Packaging: Tape and Reel; Capacitance: 100nF; Length: 0.079inch; Width: 0.049inch; Thickness: 0.053inch; Supplier Part Number 1: 1276-6733-1-ND
C34 = C0805C104K9RACTU: CAP CER 0.10uF 6.3V X7R MLCC - SMD/SMT 6.3volts 0.1uF X7R 10%; Manufacturer: KEMET; Dielectric Material: Ceramic; Supplier 1: Digi-Key; Manufacturer Part Number: C0805C104K9RACTU; Stock 1: 40000; Pricing 1: 1=0.22, 10=0.151, 100=0.0765, 500=0.0523, 1000=0.0463 (USD); Mount: Surface Mount; Case/Package: 0805; Case Code (Metric): 2012; Case Code (Imperial): 0805; Min Operating Temperature: -55°C; Max Operating Temperature: 125°C; Package Quantity: 1; Capacitance: 100nF; Tolerance: 10%; Packaging: Tape and Reel; Voltage Rating (DC): 6.3V; Dielectric: X7R; Termination: SMD/SMT; Length: 2mm; Height: 0.9mm; Width: 0.049inch; Thickness: 0.035inch; Depth: 1.25mm; Supplier Part Number 1: 399-9155-1-ND
D8-D11 = SS110-TP: DIODE SCHOTTKY 100V 1A SMA; Manufacturer: MCC; Forward Voltage: 850mV; Max Surge Current: 30A; Peak Reverse Current: 20mA; Max Reverse Leakage Current: 500uA; Element Configuration: Single; Polarity: Standard; Capacitance: 30pF; Supplier 1: Digi-Key; Manufacturer Part Number: SS110-TP; Stock 1: 56746; Pricing 1: 1=0.41, 10=0.292, 100=0.172, 500=0.0973, 1000=0.0746 (USD); Mount: Surface Mount; Case/Package: SMA; Number of Pins: 2; Min Operating Temperature: -55°C; Max Operating Temperature: 125°C; Packaging: Tape and Reel; Forward Current: 1A; Package Quantity: 1; Average Rectified Current: 1A; Peak Non-Repetitive Surge Current: 30A; Max Repetitive Reverse Voltage (Vrrm): 100V; Max Forward Surge Current (Ifsm): 30A; Voltage Rating (DC): 100V; Current Rating: 1A; Output Current: 1A; Max Reverse Voltage (DC): 100V; Length: 4.57mm; Height: 2.44mm; Width: 2.84mm; Radiation Hardening: No; REACH SVHC: Unknown; Lead Free: Lead Free; ComponentLink1URL: https://datasheet.ciiva.com/7963/1684859-7963319.pdf; ComponentLink1Description: https://datasheet.ciiva.com/7963/1684859-7963319.pdf; ComponentLink2URL: https://datasheet.ciiva.com/16742/ss12-ss110hsma-16742536.pdf; ComponentLink2Description: https://datasheet.ciiva.com/16742/ss12-ss110hsma-16742536.pdf; ComponentLink3URL: https://datasheet.ciiva.com/912/ss12-ss110hsma-912300.pdf; ComponentLink3Description: https://datasheet.ciiva.com/912/ss12-ss110hsma-912300.pdf; ComponentLink4URL: https://datasheet.ciiva.com/912/ss12-ss110hsma-912301.pdf; ComponentLink4Description: https://datasheet.ciiva.com/912/ss12-ss110hsma-912301.pdf; ComponentLink5URL: https://datasheet.ciiva.com/28382/1684859-28382109.pdf; ComponentLink5Description: https://datasheet.ciiva.com/28382/1684859-28382109.pdf; ComponentLink6URL: https://datasheet.ciiva.com/912/ss12-ss110hsma-912302.pdf; ComponentLink6Description: https://datasheet.ciiva.com/912/ss12-ss110hsma-912302.pdf; Supplier Part Number 1: SS110-TPCT-ND
D12 = SMAZ10-13-F: DIODE ZENER 10V 5% 1W 2-Pin SMA T/R; Manufacturer: Diodes; Forward Voltage: 1.2V; Zener Current: 1uA; Impedance: 4R; Test Current: 50mA; Element Configuration: Single; Supplier 1: Digi-Key; Manufacturer Part Number: SMAZ10-13-F; Stock 1: 86916; Pricing 1: 1=0.53, 10=0.397, 100=0.2476, 500=0.1694, 1000=0.1303 (USD); Mount: Surface Mount; Case/Package: SMA; Number of Pins: 2; Weight: 0.002258oz; Min Operating Temperature: -65°C; Max Operating Temperature: 150°C; Packaging: Tape and Reel; Package Quantity: 5000; Tolerance: 5%; Zener Voltage: 10V; Max Power Dissipation: 1W; Voltage Tolerance: 5%; Peak Reverse Current: 1uA; Power Dissipation: 1W; Max Reverse Leakage Current: 1uA; Working Voltage: 10V; Power Rating: 1W; Voltage Rating (DC): 10V; Length: 4.6mm; Height: 2.09mm; Width: 2.92mm; Radiation Hardening: No; Lead Free: Lead Free; ComponentLink1URL: http://www.diodes.com//datasheets/ds18015.pdf; ComponentLink1Description: http://www.diodes.com//datasheets/ds18015.pdf; Supplier Part Number 1: SMAZ10-FDICT-ND
D13 = 1PGSMC5369HR7G: DIODE ZENER 51V 5W; Manufacturer: Taiwan Semiconductor; Supplier 1: Digikey; Manufacturer Part Number: 1PGSMC5369HR7G; Stock 1: 1700; Pricing 1: 1=0.87, 10=0.765, 25=0.6772, 100=0.5899, 250=0.5134 (USD); Supplier Part Number 1: 1PGSMC5369HR7GCT-ND
Q1-Q6 = SIR186DP-T1-RE3: MOSFET N-CH 60V 60A 4.5mOhm Rds(ON); Manufacturer: Vishay Siliconix; Supplier 1: Digi-Key; Manufacturer Part Number: SIR186DP-T1-RE3; Stock 1: 4321; Pricing 1: 1=1.45, 10=1.28, 100=1.0118, 500=0.7847, 1000=0.6195 (USD); Supplier Part Number 1: SIR186DP-T1-RE3CT-ND
Q7 = FDWS9509L-F085: MOSFET P-CH PWR56 40V 8 MOHM; Manufacturer: ON Semiconductor; Supplier 1: Digi-Key; Manufacturer Part Number: FDWS9509L-F085; Stock 1: 2417; Pricing 1: 1=1.76, 10=1.562, 100=1.2344, 500=0.9573, 1000=0.7558 (USD); Supplier Part Number 1: FDWS9509L-F085OSCT-ND
R17 = RC0402JR-07100RL: RES SMD 100 OHM 5% 1/16W 0402; Manufacturer: Yageo; Power Rating: 63mW; Voltage Rating: 50V; Temperature Coefficient: 100ppm/°C; Supplier 1: Digi-Key; Manufacturer Part Number: RC0402JR-07100RL; Stock 1: 447099; Pricing 1: 1=0.1, 10=0.015, 100=0.006, 1000=0.0027, 2500=0.0023, 5000=0.0019 (USD); Case/Package: 0402; Weight: 2.3E-05oz; Case Code (Metric): 1005; Case Code (Imperial): 0402; Min Operating Temperature: -55°C; Max Operating Temperature: 155°C; Resistance: 100R; Tolerance: 5%; Packaging: Tape and Reel; Package Quantity: 1; Composition: Thick Film; Number of Terminations: 2; Termination: SMD/SMT; Military Standard: Not; Max Power Dissipation: 63mW; Features: Moisture Resistant; Length: 1mm; Height: 0.016inch; Width: 0.02inch; Depth: 0.5mm; REACH SVHC: No SVHC; Lead Free: Lead Free; Supplier Part Number 1: 311-100JRCT-ND
R18-R20 = WSLF25122L000FEA: RES SMD 0.002 OHM 1% 5W 2512; Manufacturer: Vishay Dale; Resistance: 2mR; Temperature Coefficient: 70ppm/°C; Supplier 1: Digi-Key; Manufacturer Part Number: WSLF25122L000FEA; Stock 1: 12139; Pricing 1: 1=0.78, 10=0.647, 25=0.5544, 50=0.499, 100=0.4343, 250=0.3881, 500=0.3142, 1000=0.2541 (USD); Case/Package: 2512; Case Code (Metric): 6432; Case Code (Imperial): 2512; Min Operating Temperature: -65°C; Max Operating Temperature: 170°C; Packaging: Tape and Reel; Composition: Metal Element; Number of Terminations: 2; Tolerance: 1%; Max Power Dissipation: 5W; Length: 0.25inch; Height: 0.024inch; Width: 0.125inch; Lead Free: Lead Free; Supplier Part Number 1: 541-3126-1-ND
R21-R23 R27 = RC0402FR-0734K8L: RES SMD 34.8K OHM 1% 1/16W 0402; Manufacturer: Yageo; Resistance: 34.8kR; Power Rating: 62.5mW; Voltage Rating: 50V; Temperature Coefficient: 100ppm/°C; Max Power Dissipation: 63mW; Supplier 1: Digi-Key; Manufacturer Part Number: RC0402FR-0734K8L; Stock 1: 29900; Pricing 1: 1=0.1, 10=0.018, 100=0.0073, 1000=0.0033, 2500=0.0029, 5000=0.0024 (USD); Case/Package: 0402; Case Code (Imperial): 0402; Case Code (Metric): 1005; Contact Plating: Matte,Tin; Min Operating Temperature: -55°C; Max Operating Temperature: 155°C; Tolerance: 1%; Packaging: Tape and Reel; Composition: Thick Film; Number of Terminations: 2; Termination: SMD/SMT; Military Standard: Not; Voltage Rating (DC): 50V; Features: Moisture Resistant; Length: 1mm; Height: 0.016inch; Width: 0.02inch; Depth: 0.5mm; Lead Free: Lead Free; Supplier Part Number 1: YAG3125CT-ND
R24-R26 R28 = CRCW04024R99FKEDC: RES SMD 4.99K OHM 1/16W 0402; Manufacturer: Vishay; Supplier 1: Digi-Key; Manufacturer Part Number: CRCW04024R99FKEDC; Stock 1: 7980; Pricing 1: 1=0.1, 10=0.093, 100=0.0358, 1000=0.0157, 2500=0.0136, 5000=0.0122 (USD); Supplier Part Number 1: 541-4085-1-ND
R32 = ERJ-2RKF54R9X: RES SMD 54.9K OHM 1/10W 0402 54.9 Ohm 1% 0.1W(1/10W) ±100ppm/C Molded SMD Automotive Punched T/R; Manufacturer: Panasonic; Resistance: 54.9R; Power Rating: 100mW; Voltage Rating: 50V; Temperature Coefficient: 100ppm/°C; Supplier 1: Digi-Key; Manufacturer Part Number: ERJ-2RKF54R9X; Stock 1: 343302; Pricing 1: 1=0.1, 10=0.056, 100=0.0227, 1000=0.0102, 2500=0.0089, 5000=0.0073 (USD); Mount: Surface Mount; Case/Package: 0402; Case Code (Metric): 1005; Case Code (Imperial): 0402; Contact Plating: Tin; Min Operating Temperature: -55°C; Max Operating Temperature: 155°C; Tolerance: 1%; Packaging: Tape and Reel; Package Quantity: 1; Composition: Thick Film; Number of Terminations: 2; Termination: SMD/SMT; Military Standard: Not; Max Power Dissipation: 100mW; Voltage Rating (DC): 50V; Features: Automotive AEC-Q200; Length: 1mm; Height: 0.016inch; Width: 0.02inch; Depth: 0.5mm; REACH SVHC: No SVHC; Lead Free: Lead Free; Supplier Part Number 1: P54.9LCT-ND
U5 = DRV83053PHPR: IC 3-Phase Gate Driver IC 4.4V to 45V 48-Pin HTQFP T/R; Manufacturer: Texas Instruments; Number of Drivers: 6; Number of Outputs: 1; Output Current: 80mA; Max Output Current: 1A; Supplier 1: Digi-Key; Manufacturer Part Number: DRV83053PHPR; Stock 1: 2033; Pricing 1: 1=5.04, 10=4.53, 100=3.7117, 500=3.1597 (USD); Mount: Surface Mount; Number of Pins: 48; Min Operating Temperature: -40°C; Max Operating Temperature: 125°C; Packaging: Cut Tape; Channel Type: 3-Phase; Type: Integrated Circuit (IC); Min Supply Voltage: 4.4V; Max Supply Voltage: 45V; REACH SVHC: No SVHC; Lead Free: Lead Free; ComponentLink1URL: http://www.ti.com/general/docs/lit/getliterature.tsp?genericPartNumber=DRV8305&&fileType=pdf; ComponentLink1Description: http://www.ti.com/general/docs/lit/getliterature.tsp?genericPartNumber=DRV8305&&fileType=pdf; ComponentLink2URL: http://www.ti.com/lit/pdf/slyb165; ComponentLink2Description: http://www.ti.com/lit/pdf/slyb165; ComponentLink3URL: http://www.farnell.com/datasheets/2075775.pdf; ComponentLink3Description: http://www.farnell.com/datasheets/2075775.pdf; Supplier Part Number 1: 296-42657-1-ND